# Altium schematic sheet 5_main_radio.schdoc: Main Radio
size A4; DrawnBy: Sara Vega Martinez; Revision: v0.1; SheetNumber: 5; SheetTotal: 6; DesignedBy: André M. P. Mattos
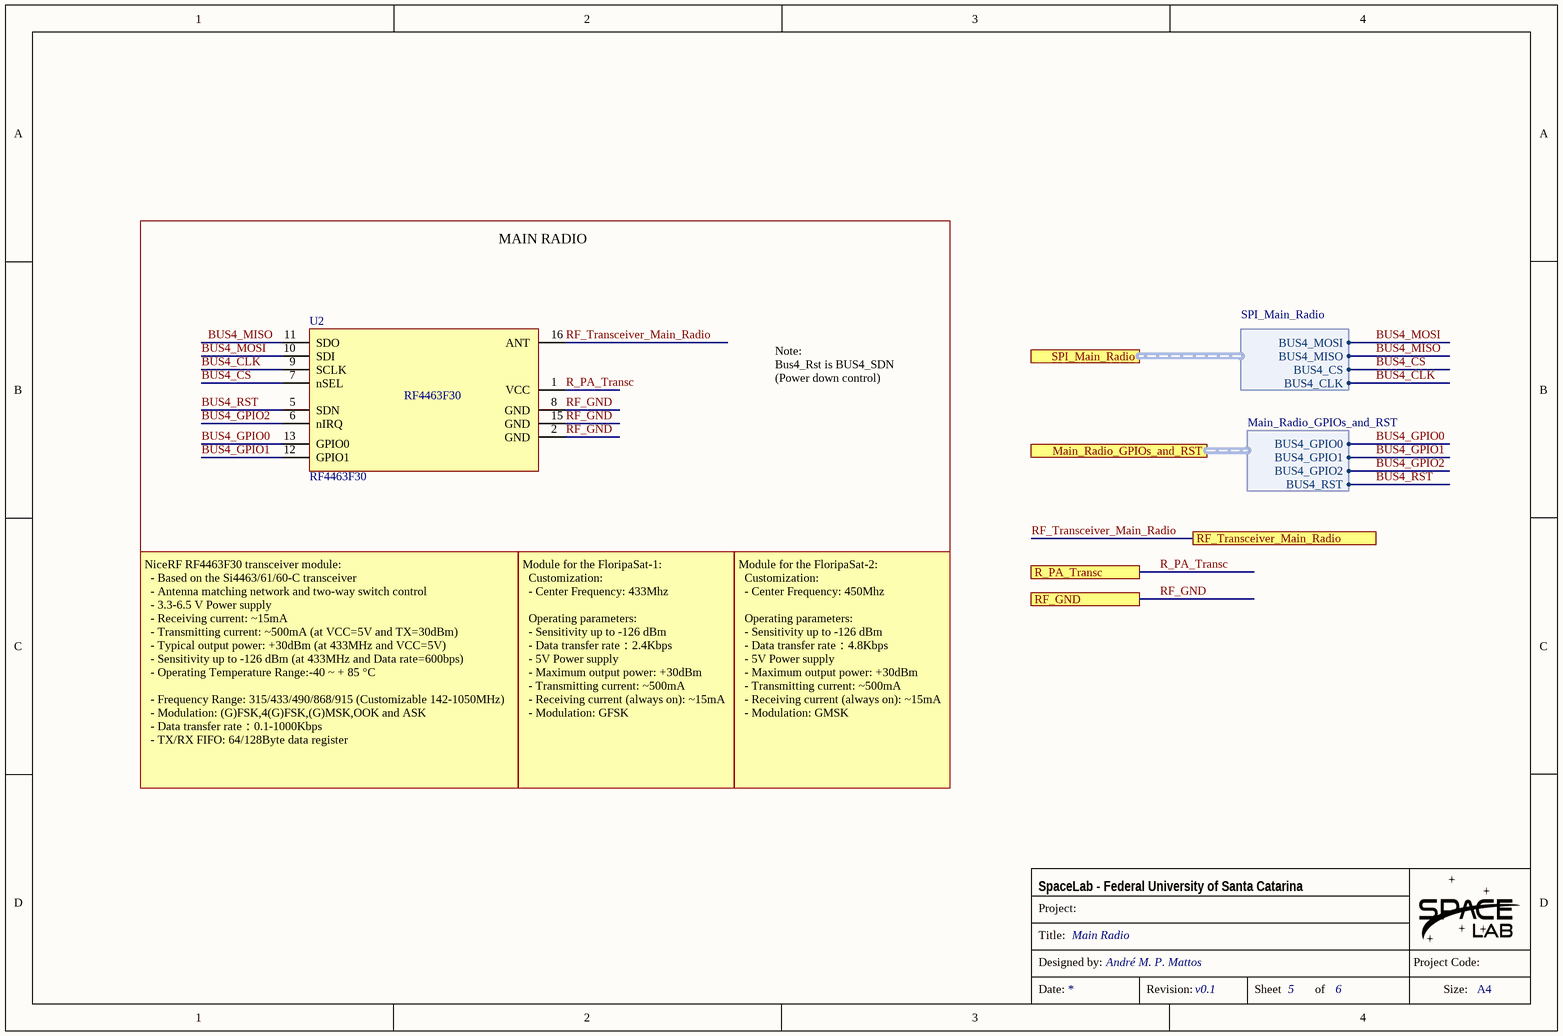
[diagram p0: 5_main_radio.schdoc]

## Parts
U2  RF4463F30  [RF4463F30]

## Blocks framed on the sheet
MAIN RADIO: U2

## Ports
Main_Radio_GPIOs_and_RST (harness Main_Radio_GPIOs_and_RST), R_PA_Transc, RF_GND, RF_Transceiver_Main_Radio, SPI_Main_Radio (harness SPI_Main_Radio)

## Harnesses
SPI_Main_Radio: BUS4_CLK, BUS4_CS, BUS4_MISO, BUS4_MOSI
Main_Radio_GPIOs_and_RST: BUS4_GPIO0, BUS4_GPIO2, BUS4_RST, BUS4_GPIO1

## Nets
BUS4_CLK: U2.9(SCLK) ; port SPI_Main_Radio.BUS4_CLK
BUS4_CS: U2.7(nSEL) ; port SPI_Main_Radio.BUS4_CS
BUS4_GPIO0: U2.13(GPIO0) ; port Main_Radio_GPIOs_and_RST.BUS4_GPIO0
BUS4_GPIO1: U2.12(GPIO1) ; port Main_Radio_GPIOs_and_RST.BUS4_GPIO1
BUS4_GPIO2: U2.6(nIRQ) ; port Main_Radio_GPIOs_and_RST.BUS4_GPIO2
BUS4_MISO: U2.11(SDO) ; port SPI_Main_Radio.BUS4_MISO
BUS4_MOSI: U2.10(SDI) ; port SPI_Main_Radio.BUS4_MOSI
BUS4_RST: U2.5(SDN) ; port Main_Radio_GPIOs_and_RST.BUS4_RST
R_PA_Transc: U2.1(VCC) ; port R_PA_Transc
RF_GND: U2.2(GND) U2.8(GND) U2.15(GND) ; port RF_GND
RF_Transceiver_Main_Radio: U2.16(ANT) ; port RF_Transceiver_Main_Radio

## Notes on the sheet
- Note:
  Bus4_Rst is BUS4_SDN
  (Power down control)
- NiceRF RF4463F30 transceiver module:
  - Based on the Si4463/61/60-C transceiver
  - Antenna matching network and two-way switch control
  - 3.3-6.5 V Power supply
  - Receiving current: ~15mA
  - Transmitting current: ~500mA (at VCC=5V and TX=30dBm)
  - Typical output power: +30dBm (at 433MHz and VCC=5V)
  - Sensitivity up to -126 dBm (at 433MHz and Data rate=600bps)
  - Operating Temperature Range:-40 ~ + 85 °C
  - Frequency Range: 315/433/490/868/915 (Customizable 142-1050MHz)
  - Modulation: (G)FSK,4(G)FSK,(G)MSK,OOK and ASK
  - Data transfer rate：0.1-1000Kbps
  - TX/RX FIFO: 64/128Byte data register
- Module for the FloripaSat-1:
  Customization:
  - Center Frequency: 433Mhz
  Operating parameters:
  - Sensitivity up to -126 dBm
  - Data transfer rate：2.4Kbps
  - 5V Power supply
  - Maximum output power: +30dBm
  - Transmitting current: ~500mA
  - Receiving current (always on): ~15mA
  - Modulation: GFSK
- Module for the FloripaSat-2:
  Customization:
  - Center Frequency: 450Mhz
  Operating parameters:
  - Sensitivity up to -126 dBm
  - Data transfer rate：4.8Kbps
  - 5V Power supply
  - Maximum output power: +30dBm
  - Transmitting current: ~500mA
  - Receiving current (always on): ~15mA
  - Modulation: GMSK
- Project:
- SpaceLab - Federal University of Santa Catarina
- Title:
- Designed by:
- Project Code:
- Date:
- Revision:
- Sheet
- of
- Size:
- A4

## Library data of the parts
U2 = RF4463F30: RF4463F30 High Power Wireless Transceiver Module; Partnumber: RF4463F30